# EAGLE schematic bc-module-battery-mini (EAGLE 7.7.0)

## Sheet 1 of 2
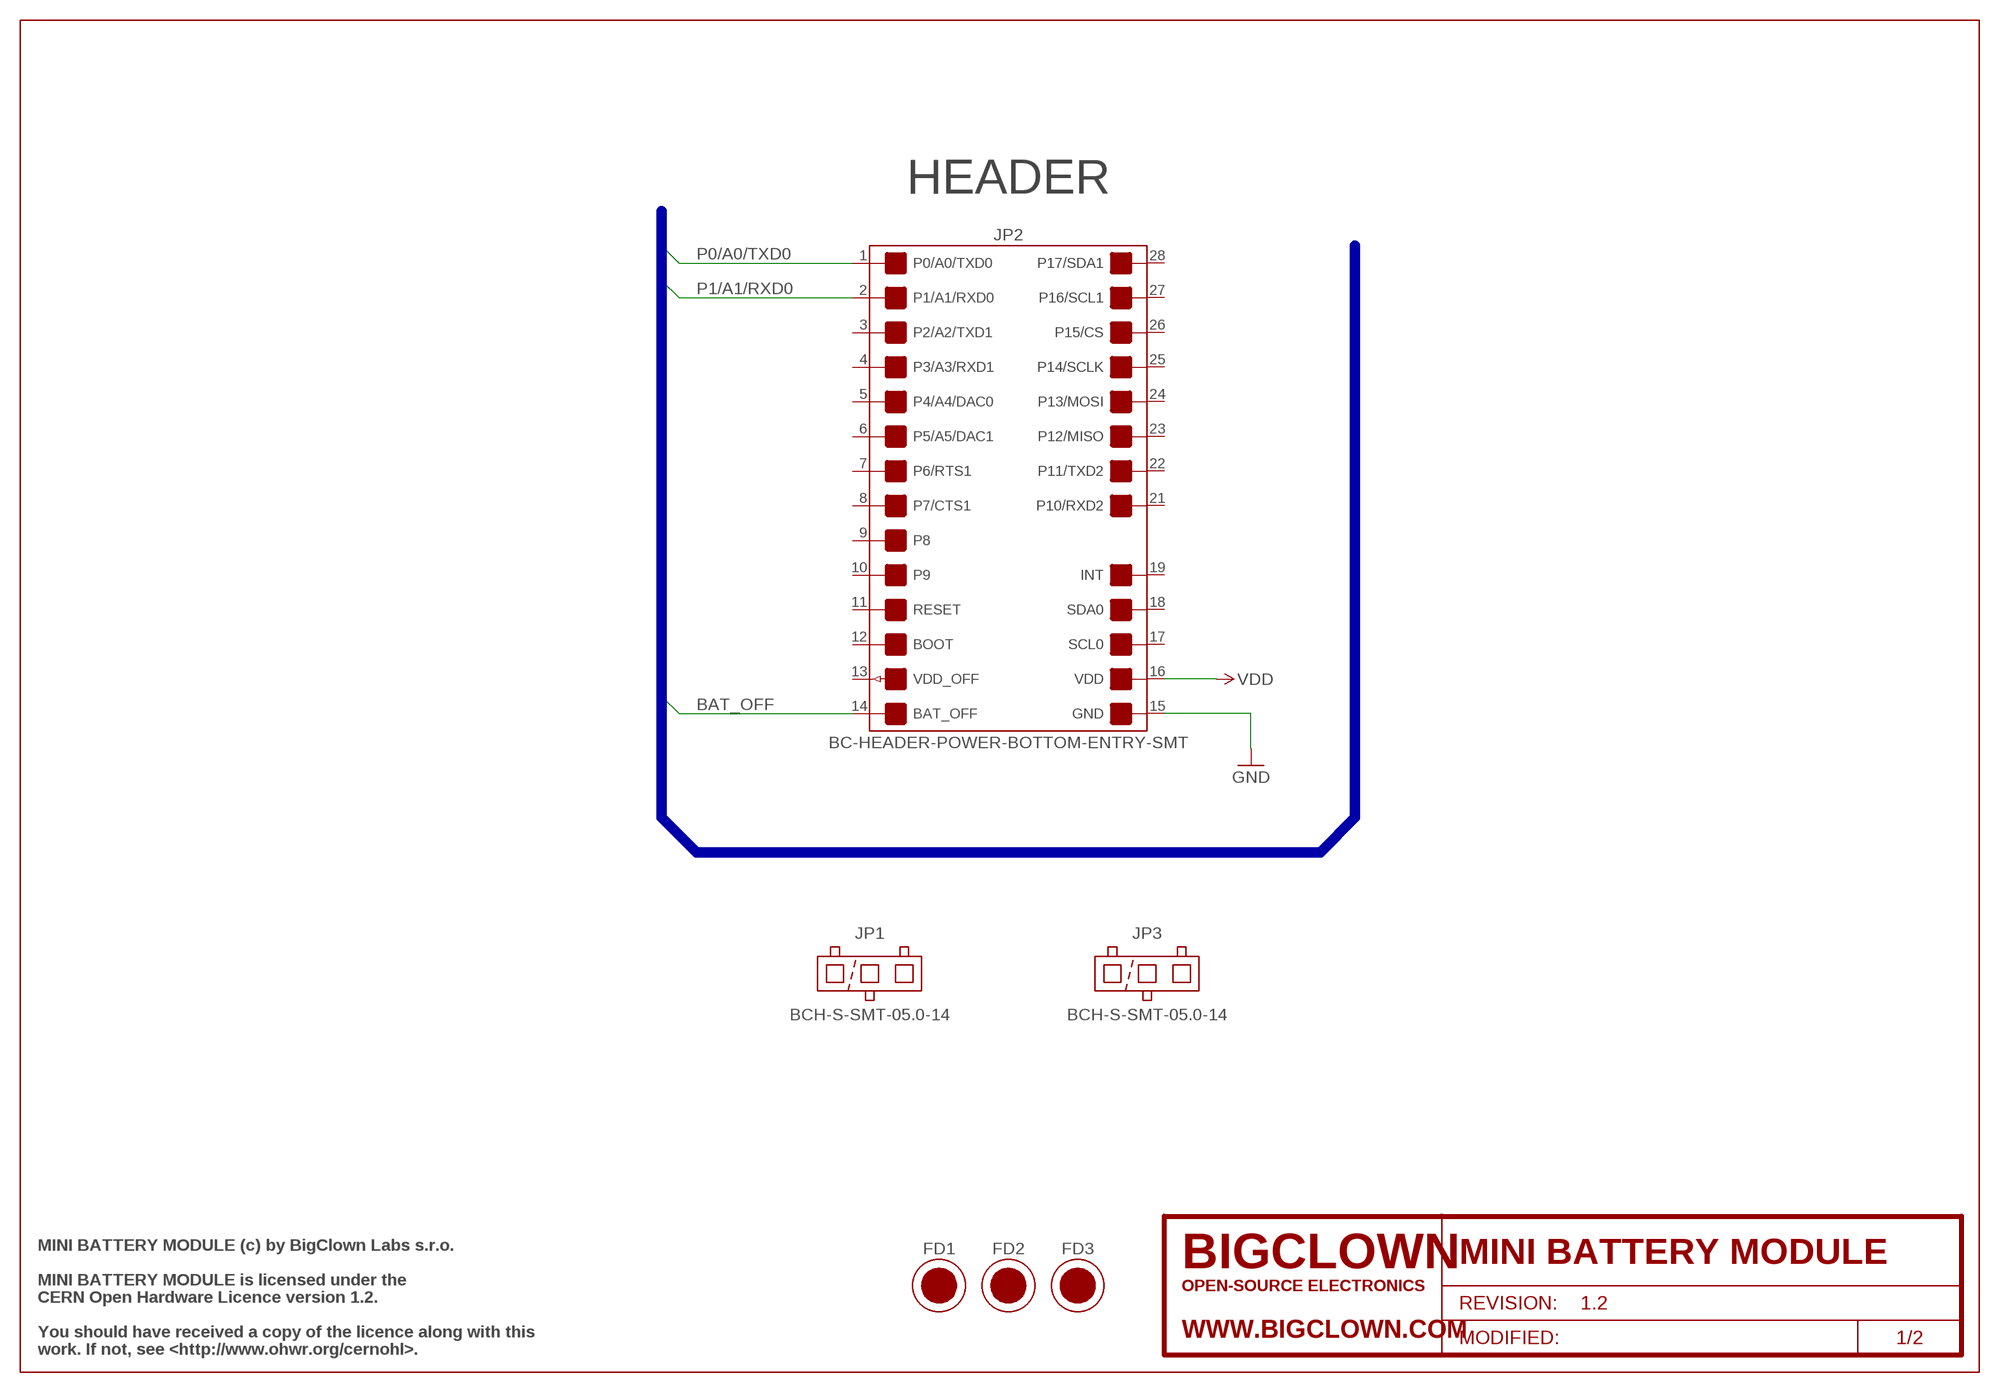
[diagram p0: schematic, sheet 1]

### Parts
FD1  FIDUCIAL  [FIDUCIAL-1MM]
FD2  FIDUCIAL  [FIDUCIAL-1MM]
FD3  FIDUCIAL  [FIDUCIAL-1MM]
FRAME1  FRAME-SCH/A4L-BRD/A4L  [FRAME-A4L]
JP1  BCH-S-SMT-05.0-14  JP-BCH-S-SMT-05.0-14  [BCH-S-SMT-14]
JP2  BC-HEADER-POWER-BOTTOM-ENTRY-SMT  [BC-HEADER-POWER-BOTTOM-ENTRY-SMT]
JP3  BCH-S-SMT-05.0-14  JP-BCH-S-SMT-05.0-14  [BCH-S-SMT-14]

### Nets
BAT_OFF: JP2.14(BAT_OFF) ; also sheet 2
GND: JP2.15(GND) ; also sheet 2
P0/A0/TXD0: JP2.1(P0/A0/TXD0) ; also sheet 2
P1/A1/RXD0: JP2.2(P1/A1/RXD0) ; also sheet 2
VDD: JP2.16(VDD) ; also sheet 2
Unconnected: JP2.3(P2/A2/TXD1) JP2.4(P3/A3/RXD1) JP2.5(P4/A4/DAC0) JP2.6(P5/A5/DAC1) JP2.7(P6/RTS1) JP2.8(P7/CTS1) JP2.9(P8) JP2.10(P9) JP2.11(RESET) JP2.12(BOOT) JP2.13(VDD_OFF_OUT) JP2.17(SCL0) JP2.18(SDA0) JP2.19(INT) JP2.21(P10/RXD2) JP2.22(P11/TXD2) JP2.23(P12/MISO) JP2.24(P13/MOSI) JP2.25(P14/SCLK) JP2.26(P15/CS) JP2.27(P16/SCL1) JP2.28(P17/SDA1)

### Buses
BAT_OFF,P0/A0/TXD0,P1/A1/RXD0

### Notes on the sheet
- HEADER
- MINI BATTERY MODULE (c) by BigClown Labs s.r.o.
- MINI BATTERY MODULE is licensed under the
- CERN Open Hardware Licence version 1.2.
- You should have received a copy of the licence along with this
- work. If not, see <http://www.ohwr.org/cernohl>.

## Sheet 2 of 2
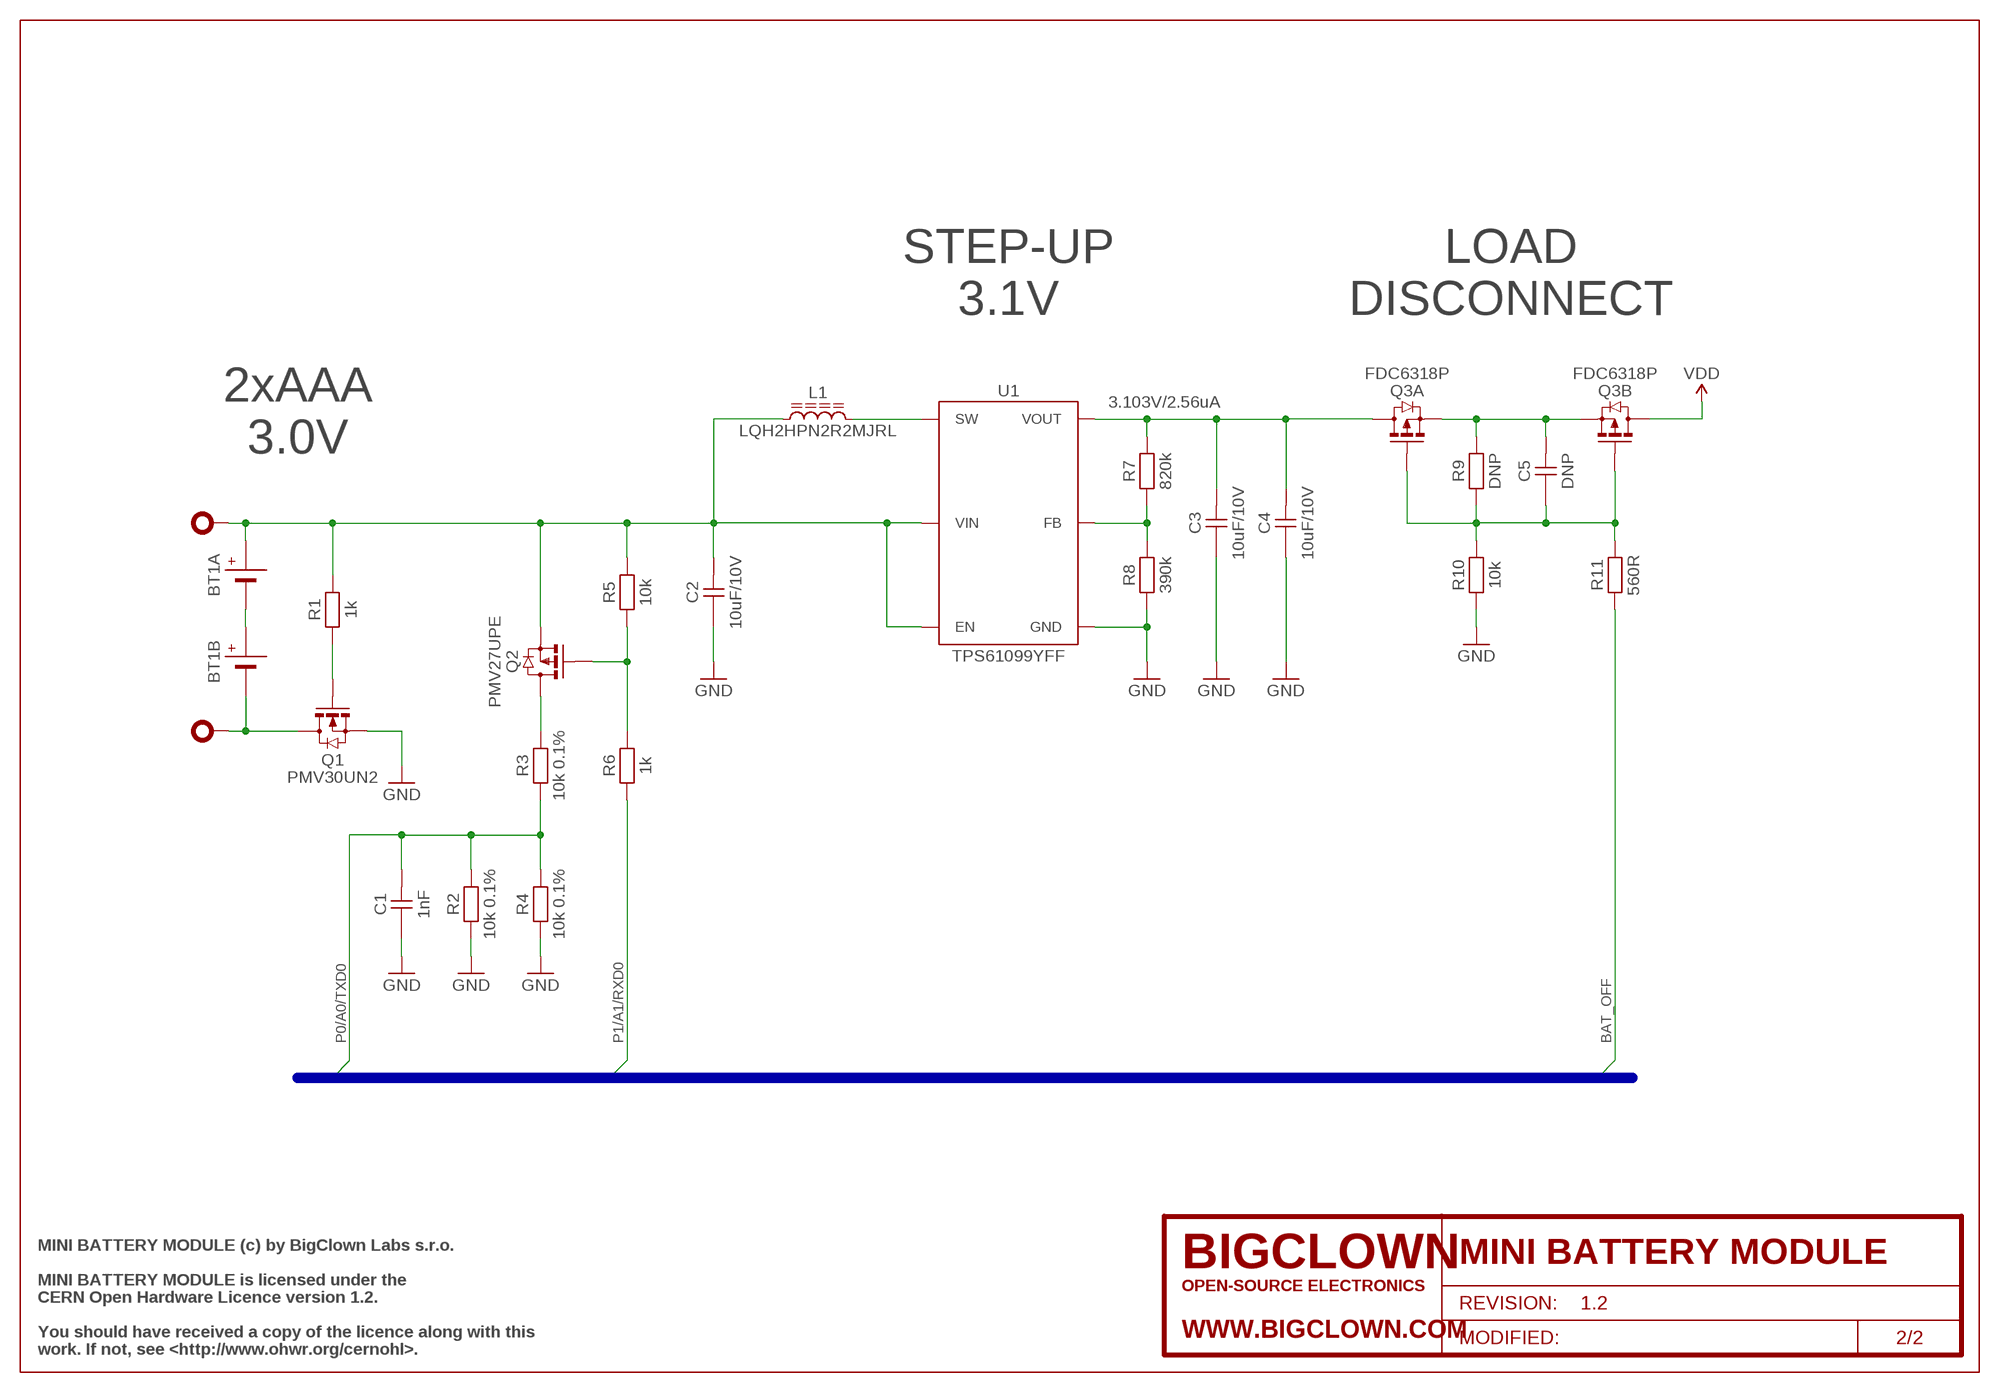
[diagram p1: schematic, sheet 2]
FRAME2 (FRAME-SCH/A4L-BRD/NONE): BCPN: -; PROJECT_NAME: MINI BATTERY MODULE; PROJECT_REVISION: 1.2

### Parts
BT1  BOSCOM-1023  BT-BOSCOM-1023-NO-LOCK  [BOSCOM-1023-NO-LOCK_T]
C1  1nF  C-0402-1NF  [CAPACITOR-0402_R]
C2  10uF/10V  C-0603-10UF-10V  [CAPACITOR-0603_R]
C3  10uF/10V  C-0603-10UF-10V  [CAPACITOR-0603_R]
C4  10uF/10V  C-0603-10UF-10V  [CAPACITOR-0603_R]
C5  DNP  C-0402-DNP  [CAPACITOR-0402_R]
JP4  BC-HEADER-PIN-THT  [BC-HEADER-PIN-THT]
JP7  BC-HEADER-PIN-THT  [BC-HEADER-PIN-THT]
L1  LQH2HPN2R2MJRL  L-LQH2HPN2R2MJRL  [LQH2HPN2R2MJRL]
Q1  PMV30UN2  Q-PMV30UN2  [SOT-23_R]
Q2  PMV27UPE  Q-PMV27UPE  [SOT-23_R]
Q3  FDC6318P  Q-FDC6318P  [SSOT-6L_R]
R1  1k  R-0402-1K  [RESISTOR-0402_R]
R2  10k 0.1%  R-0402-10K-0.1%  [RESISTOR-0402_R]
R3  10k 0.1%  R-0402-10K-0.1%  [RESISTOR-0402_R]
R4  10k 0.1%  R-0402-10K-0.1%  [RESISTOR-0402_R]
R5  10k  R-0402-10K  [RESISTOR-0402_R]
R6  1k  R-0402-1K  [RESISTOR-0402_R]
R7  820k  R-0402-820K  [RESISTOR-0402_R]
R8  390k  R-0402-390K  [RESISTOR-0402_R]
R9  DNP  R-0402-DNP  [RESISTOR-0402_R]
R10  10k  R-0402-10K  [RESISTOR-0402_R]
R11  560R  R-0402-560R  [RESISTOR-0402_R]
U1  TPS61099YFF  U-TPS61099YFF  [TPS61099YFF_R]

### Nets
+VBAT: BT1.P1(A:P) C2.1 JP7.0 L1.1 Q2.2(S) R1.2 R5.2 U1.A1(VIN) U1.C1(EN)
BAT_OFF: R11.1 ; also sheet 1
BT1A_BT1B: BT1.M1(A:M) BT1.P2(B:P)
BT1B_Q1: BT1.M2(B:M) JP4.0 Q1.3(D)
DISCONNECT_GATE: C5.2 Q3.1(A:G) Q3.3(B:G) R9.1 R10.2 R11.2
DISCONNECT_SOURCE: C5.1 Q3.2(B:S) Q3.5(A:S) R9.2
FB: R7.1 R8.2 U1.C2(FB)
GND: C1.2 C2.2 C3.2 C4.2 Q1.2(S) R2.1 R4.1 R8.1 R10.1 U1.A2(GND) ; also sheet 1
P0/A0/TXD0: C1.1 R2.2 R3.1 R4.2 ; also sheet 1
P1/A1/RXD0: R6.1 ; also sheet 1
Q2_G: Q2.1(G) R5.1 R6.2
REVERSE_G: Q1.1(G) R1.1
SW: L1.2 U1.B1(SW)
VDD: Q3.4(B:D) ; also sheet 1
VIN_SW: Q2.3(D) R3.2
VOUT: C3.1 C4.1 Q3.6(A:D) R7.2 U1.B2(VOUT)

### Buses
BAT_OFF,P0/A0/TXD0,P1/A1/RXD0

### Notes on the sheet
- STEP-UP | LOAD
- 3.1V | DISCONNECT
- 2xAAA
- 3.103V/2.56uA
- 3.0V
- MINI BATTERY MODULE (c) by BigClown Labs s.r.o.
- MINI BATTERY MODULE is licensed under the
- CERN Open Hardware Licence version 1.2.
- You should have received a copy of the licence along with this
- work. If not, see <http://www.ohwr.org/cernohl>.

## Library data of the parts
BT1 = bc-battery:BT-BOSCOM-1023-NO-LOCK; BCPN: BC-BT-BOSCOM-1023
C1 = bc-capacitor:C-0402-1NF; BCPN: BC-C-0402-1NF
C2-C4 = bc-capacitor:C-0603-10UF-10V; BCPN: BC-C-0603-10UF-10V
C5 = bc-capacitor:C-0402-DNP; BCPN: -
FD1-FD3 = bc-fiducial:FIDUCIAL; BCPN: -
FRAME1 = bc-frame:FRAME-SCH/A4L-BRD/A4L; BCPN: -; PROJECT_NAME: MINI BATTERY MODULE; PROJECT_REVISION: 1.2
JP1 JP3 = bc-header:JP-BCH-S-SMT-05.0-14; BCPN: BC-JP-BCH-S-SMT-05.0-14
JP2 = bc-header:BC-HEADER-POWER-BOTTOM-ENTRY-SMT; BCPN: -
JP4 JP7 = bc-header:BC-HEADER-PIN-THT; BCPN: -
L1 = bc-inductor:L-LQH2HPN2R2MJRL; BCPN: BC-L-LQH2HPN2R2MJRL
Q1 = bc-discrete:Q-PMV30UN2; BCPN: BC-Q-PMV30UN2
Q2 = bc-discrete:Q-PMV27UPE; BCPN: BC-Q-PMV27UPE
Q3 = bc-discrete:Q-FDC6318P; BCPN: BC-Q-FDC6318P
R1 R6 = bc-resistor:R-0402-1K; BCPN: BC-R-0402-1K
R2-R4 = bc-resistor:R-0402-10K-0.1%; BCPN: BC-R-0402-10k-0.1%
R5 R10 = bc-resistor:R-0402-10K; BCPN: BC-R-0402-10K
R7 = bc-resistor:R-0402-820K; BCPN: BC-R-0402-820K
R8 = bc-resistor:R-0402-390K; BCPN: BC-R-0402-390K
R9 = bc-resistor:R-0402-DNP; BCPN: -
R11 = bc-resistor:R-0402-560R; BCPN: BC-R-0402-560R
U1 = bc-power:U-TPS61099YFF; BCPN: BC-U-TPS61099YFF